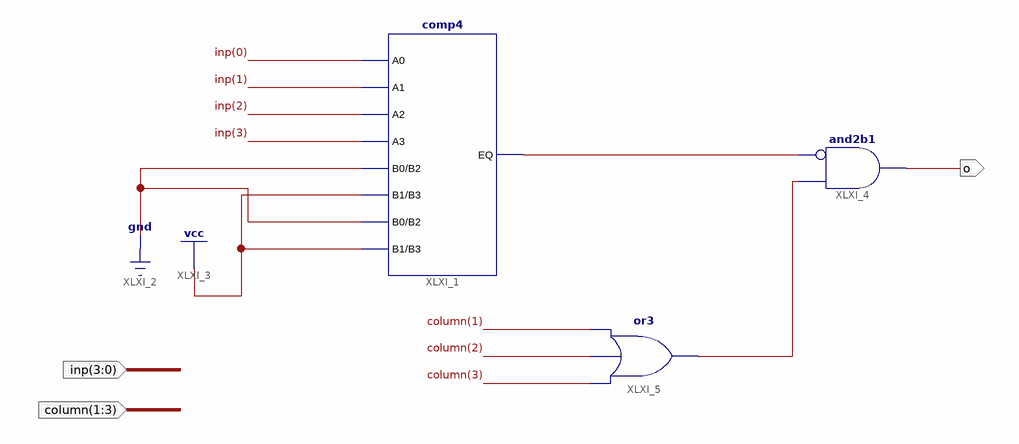
[diagram p0: schematic sheet 1]
// Xilinx ISE schematic checkInput.sch (spartan6) as structural Verilog: 3 symbols, 3 ports
module checkInput (
  input  [3:0] inp,
  input  [1:3] column,
  output o
);

  wire XLXN_8, XLXN_9;

  comp4 XLXI_1 (
    .A0(inp[0]), .A1(inp[1]), .A2(inp[2]), .A3(inp[3]), .B0(1'b0), .B1(1'b1), .B2(1'b0), .B3(1'b1),
    .EQ(XLXN_8));
  and XLXI_4 (o, ~XLXN_8, XLXN_9);  // and2b1
  or XLXI_5 (XLXN_9, column[1], column[2], column[3]);
endmodule
